# EAGLE design HVAC Control (EAGLE 9.6.2)
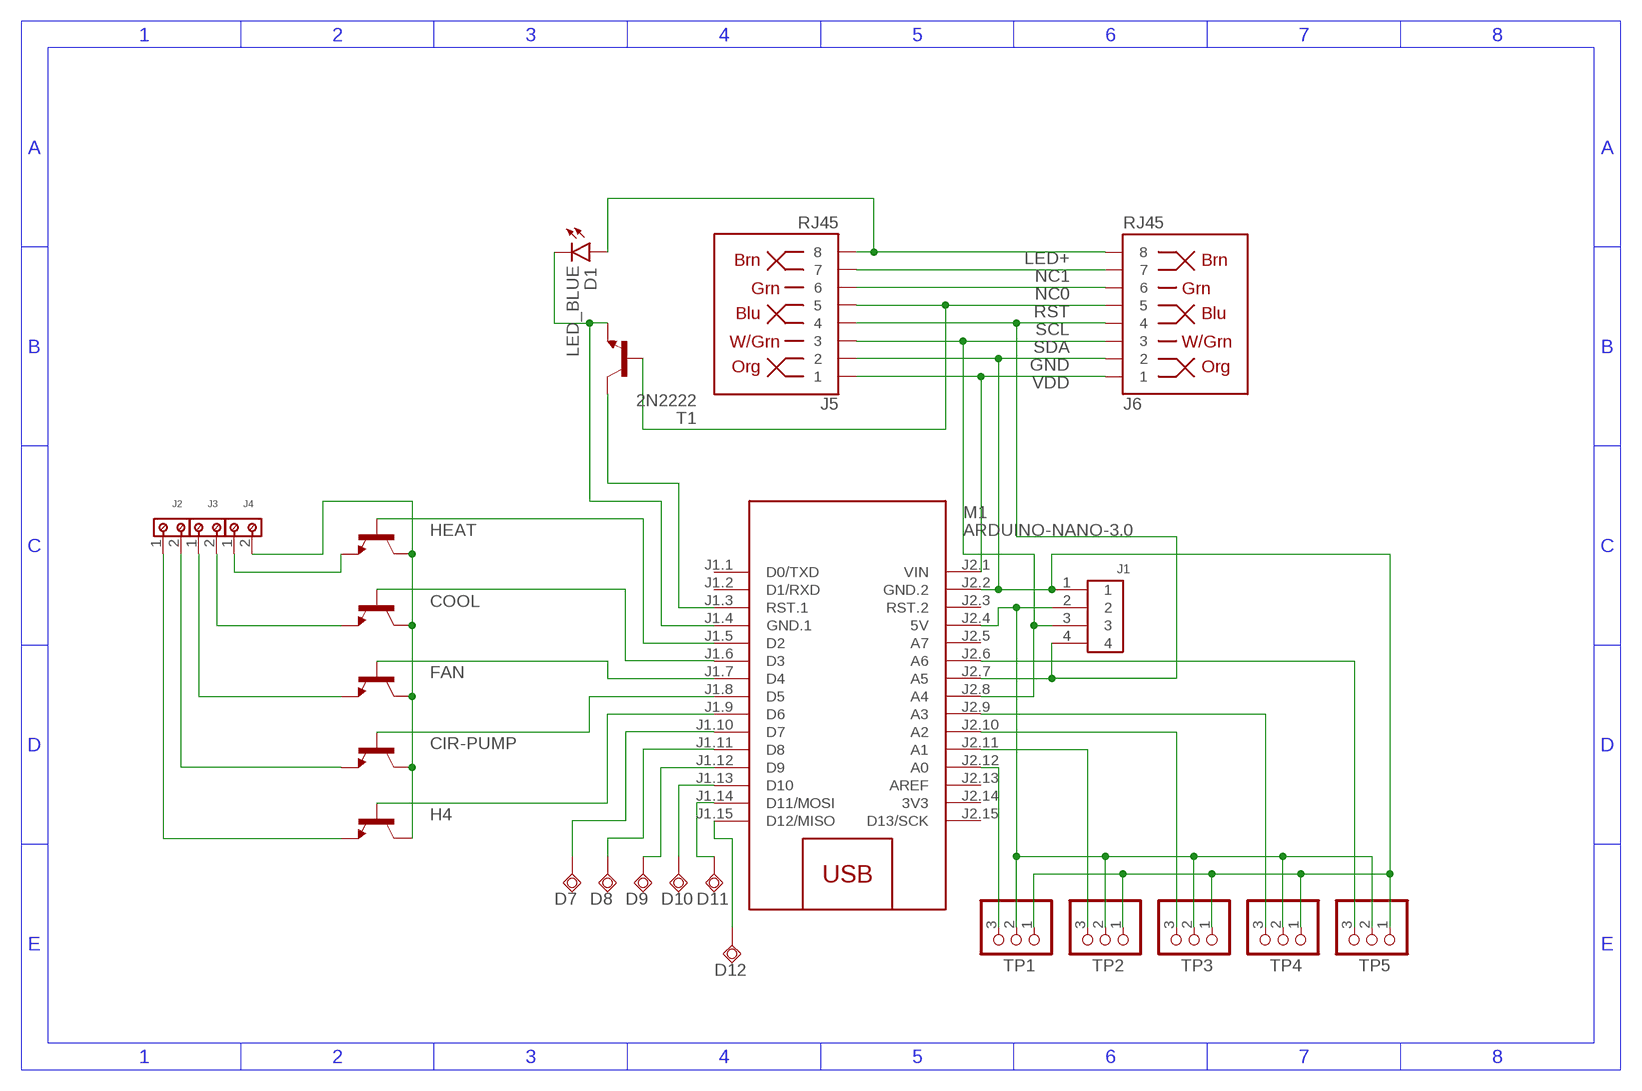
[diagram p0: schematic, sheet 1]

## Parts
CIR-PUMP  600mA/40V  TRANS_NPN-P2N2222A  [TO-92]
COOL  600mA/40V  TRANS_NPN-P2N2222A  [TO-92]
D1  LED_BLUE  LED_RADIAL_BLUE  [LEDRD254W60D565H860B_B]
D7  TESTPAD_TPSQPAD1-13  [TESTPAD_P1-13]
D8  TESTPAD_TPSQPAD1-13  [TESTPAD_P1-13]
D9  TESTPAD_TPSQPAD1-13  [TESTPAD_P1-13]
D10  TESTPAD_TPSQPAD1-13  [TESTPAD_P1-13]
D11  TESTPAD_TPSQPAD1-13  [TESTPAD_P1-13]
D12  TESTPAD_TPSQPAD1-13  [TESTPAD_P1-13]
FAN  600mA/40V  TRANS_NPN-P2N2222A  [TO-92]
H4  600mA/40V  TRANS_NPN-P2N2222A  [TO-92]
HEAT  600mA/40V  TRANS_NPN-P2N2222A  [TO-92]
J1  B4B-XH-A(LF)(SN)  [B4B-XH-A(LF)(SN)]
J2  691201820002  [691201820002]
J3  691201820002  [691201820002]
J4  691201820002  [691201820002]
J5  RJ45  RJ45-8  [RJ45-8]
J6  RJ45  RJ45-8  [RJ45-8]
M1  ARDUINO-NANO-3.0  [ARDUINO-NANO-3.0]
T1  2N2222  [TO18]
TP1  PINHD-1X3  [1X03]
TP2  PINHD-1X3  [1X03]
TP3  PINHD-1X3  [1X03]
TP4  PINHD-1X3  [1X03]
TP5  PINHD-1X3  [1X03]

## Nets
GND: J1.1 J5.2 J6.2 M1.J2.2(GND.2) M1.J2.3(RST.2) TP1.1 TP2.1 TP3.1 TP4.1 TP5.1
LED+: D1.1(A) J5.8 J6.8
N$1: D7.TP M1.J1.10(D7)
N$2: J1.2 M1.J2.4(5V) TP1.2 TP2.2 TP3.2 TP4.2 TP5.2
N$3: D8.TP M1.J1.11(D8)
N$4: D9.TP M1.J1.12(D9)
N$5: HEAT.2(B) M1.J1.5(D2)
N$6: COOL.2(B) M1.J1.6(D3)
N$7: FAN.2(B) M1.J1.7(D4)
N$8: CIR-PUMP.2(B) M1.J1.8(D5)
N$9: H4.2(B) M1.J1.9(D6)
N$10: CIR-PUMP.1(C) COOL.1(C) FAN.1(C) H4.1(C) HEAT.1(C) J4.2
N$11: H4.3(E) J2.1
N$12: CIR-PUMP.3(E) J2.2
N$13: FAN.3(E) J3.1
N$14: COOL.3(E) J3.2
N$15: HEAT.3(E) J4.1
N$16: M1.J2.12(A0) TP1.3
N$17: M1.J2.11(A1) TP2.3
N$18: M1.J2.10(A2) TP3.3
N$19: M1.J2.9(A3) TP4.3
N$20: M1.J2.6(A6) TP5.3
N$21: M1.J1.3(RST.1) T1.3(C)
N$22: D1.2(C) M1.J1.4(GND.1) T1.1(E)
N$23: D10.TP M1.J1.13(D10)
N$24: D11.TP M1.J1.14(D11/MOSI)
N$25: D12.TP M1.J1.15(D12/MISO)
NC0: J5.6 J6.6
NC1: J5.7 J6.7
RST: J5.5 J6.5 T1.2(B)
SCL: J1.4 J5.4 J6.4 M1.J2.7(A5)
SDA: J1.3 J5.3 J6.3 M1.J2.8(A4)
VDD: J5.1 J6.1 M1.J2.1(VIN)
Unconnected: M1.J1.1(D0/TXD) M1.J1.2(D1/RXD) M1.J2.5(A7) M1.J2.13(AREF) M1.J2.15(D13/SCK)

## Power pins joined to a net without a drawn wire
3V3: M1.J2.14(3V3)

## Library data of the parts
CIR-PUMP COOL FAN H4 HEAT = SparkFun-DiscreteSemi:TRANS_NPN: NPN transistor Current controlled devices typically used to amplify current or used as a switch. BC547 - COM-08928 <http://www.sparkfun.com/products/8928> (TO-92 45V 100mA) (1.Collector 2.Base 3.Emitter) 2N3904 - COM-00521 <http://www.sparkfun.com/products/521> (TO-92 40V 200mA) (1.Emitter 2.Base 3.Collector) P2N2222A - COM-12852 <http://www.sparkfun.com/products/12852> (TO-92 40V 600mA) (1.Collector 2.Base 3.Emitter); PROD_ID: TRANS-09536
D1 = Opto-Electronic:LED_RADIAL: LED - Generic; CATEGORY: Opto-Electronic; SUB-CATEGORY: LED
D7-D12 = BeagleBone_Blue_R3:TESTPAD_TPSQ: Test pad
J1 = Headers:B4B-XH-A(LF)(SN): CONN HEADER VERT 4POS 2.5MM Manufacturer's datasheet <http://www.jst-mfg.com/product/pdf/eng/eXH.pdf>; CREATED_BY: PCBLayout.com; DIGIKEY_PARTNO: 455-2249-ND; MANUFACTURER: JST Sales America Inc.; MPN: B4B-XH-A(LF)(SN)
J2-J4 = Wurth_Connectors_WR-TBL Rising Cage Clamp:691201820002: WR-TBL Serie 2018 - 10.00 mm 45° Entry w. Rising Cage Clamp KIND PROPERTIES Pitch 10 mm MATERIAL PROPERTIES Insulator Material PA6/66 Insulator Flammability Rating UL94 V-0 Insulator Color Grey Contact Material Steel Contact Plating Zinc Terminal Screw Material Steel Terminal Screw Plating Zinc Wire Guard Material Copper Alloy with Tin over Nickel GENERAL INFORMATION Operating Temperature -30 up to +120 °C Compliance Lead free / RoHS ELECTRICAL PROPERTIES IR UL 16 A IR VDE 24 A Working Voltage [UL] 300 V (AC) Working Voltage [VDE] 750 V (AC) Withstanding Voltage [UL] 1600 V (AC) Withstanding Voltage [VDE] 3000 V (AC) Contact Resistance 20 mΩ MECHANICAL PROPERTIES Wire Strip Length 6 (mm) Screw M3 CERTIFICATION UL Approval E150931; E150931 Cat No. COB (2) VDE Approval 40022115 VDE Approval 40022115 Type COB PACKAGING PROPERTIES Packaging Box <https://www.we-online.com/catalog/media/o84027v209%20Family_WR-TBL_6912018200xx.jpg> Details see: https://www.we-online.com/catalog/en/TBL_10_00_2018_45-DEGREE_ENTRY_W_RISING_CAGE_CLAMP_6912018200xx/ Updated by Ella Wu 2019-12-02 2019(C) Wurth Elektronik; IR-UL: 16A; IR-VDE: 24A; PART-NUMBER: 691201820002; PINS: 2; PITCH: 10mm; TYPE: 45°; WIRE: 12 to 30 (AWG) 3.31 to 0.05 (mm²); WORKING-VOLTAGE-UL: 300V (AC); WORKING-VOLTAGE-VDE: 750V (AC)
J5 J6 = SparkFun-Connectors:RJ45-8: RJ45 Jack - 8 pin Simple RJ45, 8-pin connection. Commonly used for Cat5, Cat5e, and Cat6 Ethernet cables. Here is the connector we sell at SparkFun: RJ45 8-Pin Connector <https://www.sparkfun.com/products/643> (PRT-00643) Datasheet <https://cdn.sparkfun.com/datasheets/Prototyping/04908.pdf> It is used on this SparkFun product: SparkFun RJ45 Breakout <https://www.sparkfun.com/products/716> (BOB-00716) Note, you may also be interested in the "MAGJACK" version of this. It is basically a RJ45 connector, but also has some status LEDs built into the connector housing. You can check that out in this library at the device named "MAGJACK.dev" and see these products online: RJ45 Ethernet MagJack-Compatible <https://www.sparkfun.com/products/8534> (PRT-08534) SparkFun RJ45 MagJack Breakout <https://www.sparkfun.com/products/13021> (BOB-13021); PROD_ID: CONN-08506; SF_ID: PRT-00643
M1 = diy-modules-2:ARDUINO-NANO-3.0: Arduino Nano 3.0
T1 = transistor:2N2222: NPN TRANSISTOR
TP1-TP5 = Connector:PINHD-1X3: PIN HEADER; CATEGORY: CONNECTOR; SUB-CATEGORY: PIN-HEADER

## Board
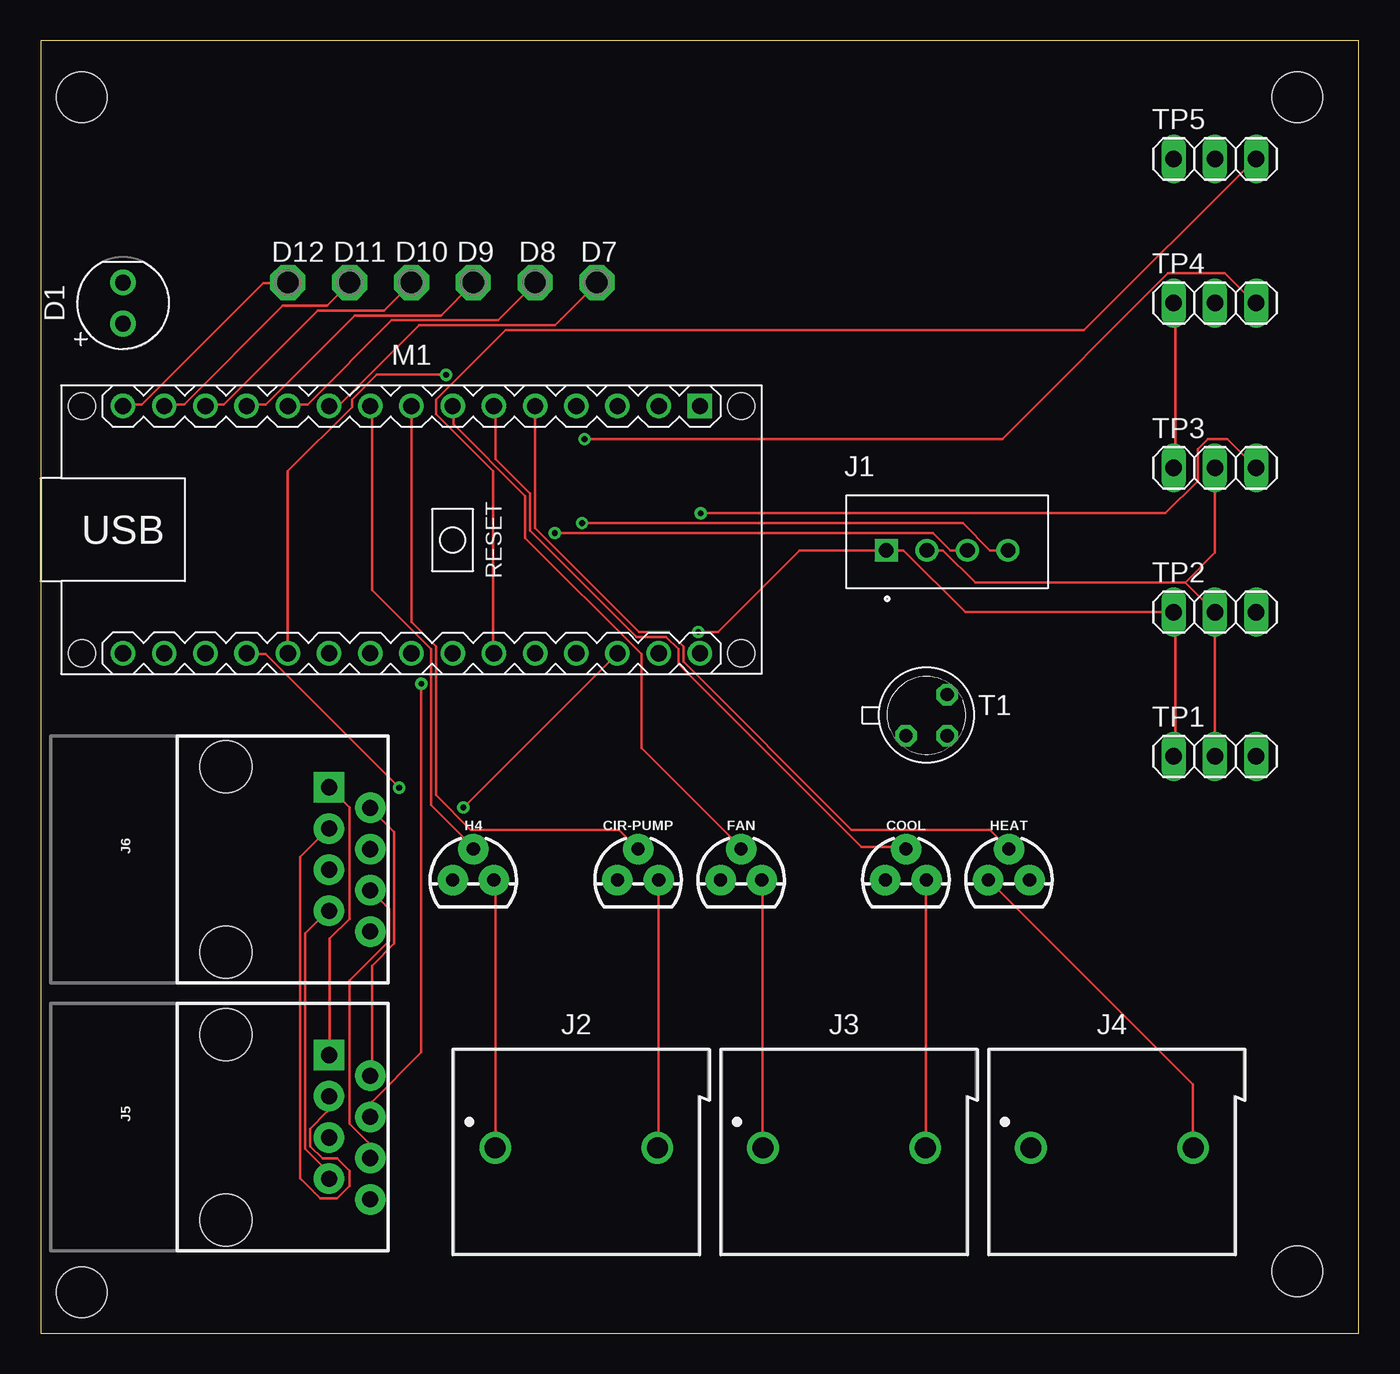
[diagram p1: board, top side]
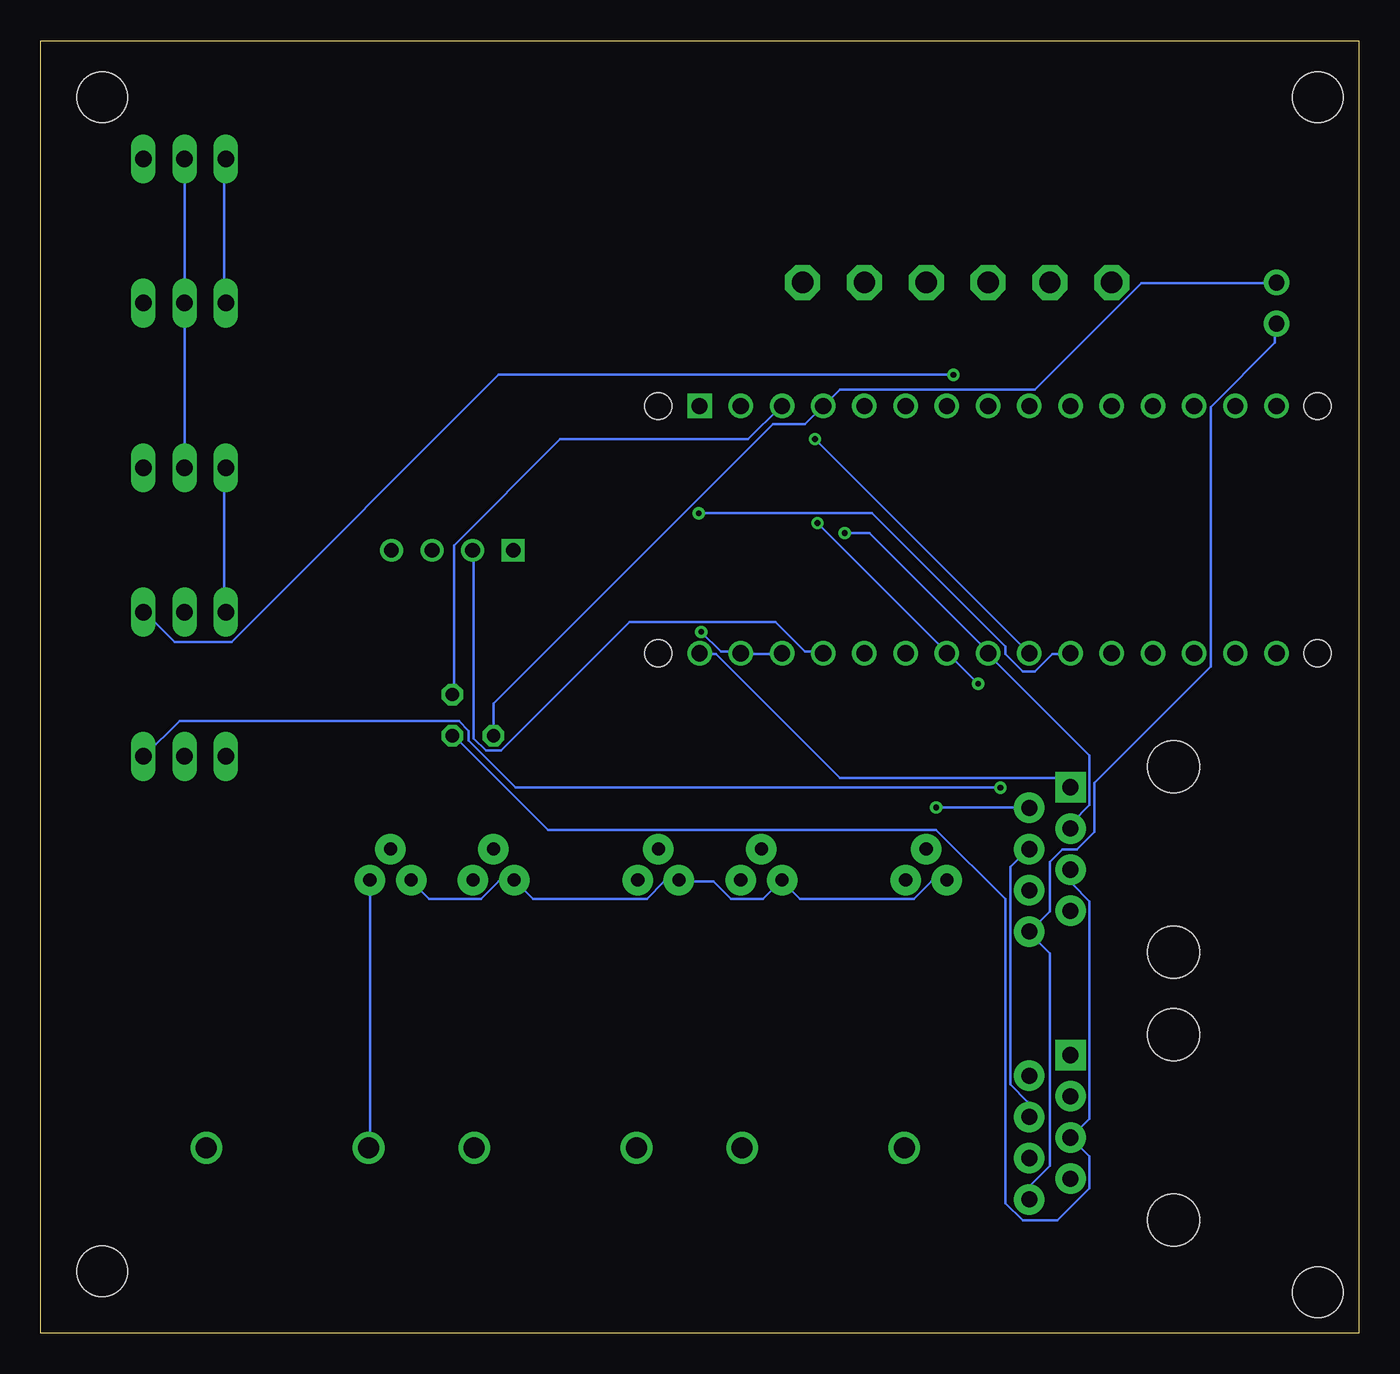
[diagram p2: board, bottom side, seen from below]

Size 81.26 x 79.68 mm. Coordinates in mm from the lower left corner, seen from the top.
Outline: 0,0 81.26,0 81.26,79.68 0,79.68 0,0
Copper layers (1*16): Top 0.035mm / dielectric 0.15mm / Bottom 0.035mm
Design rules "default": minimum track width 6mil, minimum drill 0.35mm, track to track 6mil, track to pad 6mil, pad to pad 6mil, via to via 6mil, smd to smd 6mil, copper to edge 40mil, drill to drill 6mil, minimum pad ring 10mil, minimum via ring 8mil, stop-mask expansion 4mil, vias tented up to drill 0mil, thermal gap 10mil
Holes 3.1 mm at 2.54,76.2 77.47,76.2 77.47,3.81 2.54,2.54

### Footprints (pad centres in the part's own frame; a part is rotated, then mirrored left to right if it is on the bottom)
TO-92 = drill 0.813 pad 1.88: 1 -1.27,0; 2 0,1.905; 3 1.27,0
LEDRD254W60D565H860B_B = drill 0.981 pad 1.581: 1 -1.27,0; 2 1.27,0
TESTPAD_P1-13 = drill 1.321 pad 2.159 octagon: TP 0,0
B4B-XH-A(LF)(SN) = drill 0.9 square: 1 -3.75,0 | drill 0.9: 2 -1.25,0; 3 1.25,0; 4 3.75,0
691201820002 = drill 1.3: 1 -5,0; 2 5,0
RJ45-8 = drill 1 pad 1.88 square: 1 -4.445,6.35 | drill 1 pad 1.88: 2 -3.175,8.89; 3 -1.905,6.35; 4 -0.635,8.89; 5 0.635,6.35; 6 1.905,8.89; 7 3.175,6.35; 8 4.445,8.89 | hole 3.2: -5.715,0; 5.715,0
ARDUINO-NANO-3.0 = drill 1 square: J1.1 17.78,7.62 | drill 1: J1.2 15.24,7.62; J1.3 12.7,7.62; J1.4 10.16,7.62; J1.5 7.62,7.62; J1.6 5.08,7.62; J1.7 2.54,7.62; J1.8 0,7.62; J1.9 -2.54,7.62; J1.10 -5.08,7.62; J1.11 -7.62,7.62; J1.12 -10.16,7.62; J1.13 -12.7,7.62; J1.14 -15.24,7.62; J1.15 -17.78,7.62; J2.1 17.78,-7.62; J2.2 15.24,-7.62; J2.3 12.7,-7.62; J2.4 10.16,-7.62; J2.5 7.62,-7.62; J2.6 5.08,-7.62; J2.7 2.54,-7.62; J2.8 0,-7.62; J2.9 -2.54,-7.62; J2.10 -5.08,-7.62; J2.11 -7.62,-7.62; J2.12 -10.16,-7.62; J2.13 -12.7,-7.62; J2.14 -15.24,-7.62; J2.15 -17.78,-7.62 | hole 1.651: -20.32,7.62; -20.32,-7.62; 20.32,-7.62; 20.32,7.62
TO18 = drill 0.813 octagon: 1 -1.27,-1.27; 2 1.27,-1.27; 3 1.27,1.27
1X03 = drill 1.016 long: 1 -2.54,0; 2 0,0; 3 2.54,0

### Placement (x,y rotation side)
CIR-PUMP  36.83,27.94 0 top
COOL  53.34,27.94 0 top
D1  5.08,63.5 90 top
D7  34.29,64.77 0 top
D8  30.48,64.77 0 top
D9  26.67,64.77 0 top
D10  22.86,64.77 0 top
D11  19.05,64.77 0 top
D12  15.24,64.77 0 top
FAN  43.18,27.94 0 top
H4  26.67,27.94 0 top
HEAT  59.69,27.94 0 top
J1  55.88,48.26 0 top
J2  33.02,11.43 0 top
J3  49.53,11.43 0 top
J4  66.04,11.43 0 top
J5  11.43,12.7 270 top
J6  11.43,29.21 270 top
M1  22.86,49.53 0 top
T1  54.61,38.1 0 top
TP1  72.39,35.56 0 top
TP2  72.39,44.45 0 top
TP3  72.39,53.34 0 top
TP4  72.39,63.5 0 top
TP5  72.39,72.39 0 top

### Tracks (layer width: path | path; a pad name or v marks a point on that pad's centre or on a via)
GND  (via drill 0.35)
  Top 0.152: J5.2 20.42,15.95 20.42,22.66 21.79,24.03 21.79,30.89 20.42,32.26 J6.2 | TP1.1 69.95,35.61 69.95,44.45 TP2.1 57,44.45 53.19,48.26 J1.1 46.79,48.26 41.76,43.23 v40.54,43.23 | TP4.1 69.95,63.5 69.95,53.44 TP3.1 | M1.J2.3 v26.06,32.41
  Bottom 0.152: TP4.1 69.95,63.5 69.95,72.34 TP5.1 | M1.J2.3 35.66,41.86 38.1,41.86 M1.J2.2 38.1,42.01 39.32,42.01 v40.54,43.23 | TP3.1 69.95,53.29 69.95,44.45 TP2.1 | v26.06,32.41 20.42,32.41 J6.2
LED+
  Bottom 0.152: D1.1 5.18,62.13 5.18,61.06 9.14,57.1 9.14,41.1 16.31,33.93 16.31,30.89 17.37,29.82 18.29,29.82 19.05,29.06 19.05,26.01 20.27,24.79 J6.8 20.27,24.64 19.05,23.42 19.05,10.31 20.27,9.09 20.27,8.33 J5.8
N$1
  Top 0.152: M1.J1.10 17.83,57.25 18.44,57.25 23.32,62.13 31.7,62.13 34.29,64.72 D7.TP
N$2
  Top 0.152: J1.2 55.63,48.26 57.61,46.28 70.56,46.28 | 70.56,46.28 TP2.2 TP1.2 | TP3.2 72.39,48.11 70.56,46.28
  Bottom 0.152: TP5.2 TP4.2 TP3.2 | M1.J2.4 33.07,42.01 34.14,42.01 35.97,43.84 44.96,43.84 52.88,35.92 53.8,35.92 54.56,36.68 54.56,48.26 J1.2
N$3
  Top 0.152: M1.J1.11 15.24,57.25 16.46,57.25 21.64,62.43 28.19,62.43 30.48,64.72 D8.TP
N$4
  Top 0.152: M1.J1.12 12.8,57.25 13.87,57.25 19.36,62.74 24.69,62.74 26.67,64.72 D9.TP
N$5
  Top 0.152: M1.J1.5 30.48,49.63 36.88,43.23 38.71,43.23 39.62,42.32 39.62,41.4 49.99,31.04 58.52,31.04 59.59,29.97 HEAT.2
N$6
  Top 0.152: M1.J1.6 28.04,57.1 28.04,53.9 30.18,51.76 30.18,49.48 36.73,42.93 38.56,42.93 39.32,42.16 39.32,41.25 50.6,29.97 53.34,29.97 COOL.2
N$7
  Top 0.152: M1.J1.7 25.45,57.1 25.45,56.03 29.87,51.61 29.87,49.02 37.03,41.86 37.03,36.07 43.13,29.97 FAN.2
N$8
  Top 0.152: M1.J1.8 22.86,43.84 24.38,42.32 24.38,33.17 26.52,31.04 35.66,31.04 36.73,29.97 CIR-PUMP.2
N$9
  Top 0.152: M1.J1.9 20.42,57.1 20.42,45.82 24.08,42.16 24.08,32.56 26.67,29.97 H4.2
N$10
  Top 0.152: HEAT.1 71.02,15.34 71.02,11.53 J4.2
  Bottom 0.152: H4.1 25.45,27.84 26.36,27.84 27.43,26.77 34.44,26.77 35.51,27.84 CIR-PUMP.1 36.73,26.77 38.71,26.77 39.78,27.84 41.91,27.84 | HEAT.1 58.37,27.84 57.3,26.77 54.1,26.77 53.03,27.84 52.12,27.84 COOL.1 50.9,26.77 43.89,26.77 42.82,27.84 41.91,27.84 | 41.91,27.84 FAN.1
N$11
  Top 0.152: H4.3 28.04,27.84 28.04,11.53 J2.1
N$12
  Top 0.152: CIR-PUMP.3 38.1,11.53 J2.2
N$13
  Top 0.152: FAN.3 44.5,27.84 44.5,11.53 J3.1
N$14
  Top 0.152: COOL.3 54.56,27.84 54.56,11.53 J3.2
N$15
  Bottom 0.152: HEAT.3 60.96,11.53 J4.1
N$16  (via drill 0.35)
  Top 0.152: v22.1,33.63 13.87,41.86 12.8,41.86 M1.J2.12
  Bottom 0.152: v22.1,33.63 51.97,33.63 54.86,36.52 54.86,37.13 55.47,37.74 72.69,37.74 74.83,35.61 TP1.3
N$17  (via drill 0.35)
  Top 0.152: M1.J2.11 15.24,53.14 19.2,57.1 19.2,57.56 20.73,59.08 v24.99,59.08
  Bottom 0.152: v24.99,59.08 53.03,59.08 69.49,42.62 73,42.62 74.83,44.45 TP2.3
N$18  (via drill 0.35)
  Top 0.152: v40.69,50.55 69.34,50.55 71.32,52.53 71.32,54.51 71.93,55.12 73.15,55.12 TP3.3
  Bottom 0.152: v40.69,50.55 30.02,50.55 21.79,42.32 21.79,41.86 20.73,40.79 19.96,40.79 18.9,41.86 17.83,41.86 M1.J2.10
N$19  (via drill 0.35)
  Top 0.152: v33.53,55.12 59.28,55.12 69.49,65.33 73,65.33 74.83,63.5 TP4.3
  Bottom 0.152: v33.53,55.12 M1.J2.9
N$20
  Top 0.152: M1.J2.6 27.89,42.01 27.89,53.14 24.38,56.64 24.38,57.56 28.65,61.82 64.31,61.82 74.83,72.34 TP5.3
N$21
  Bottom 0.152: T1.3 55.78,39.42 55.78,48.57 49.23,55.12 37.64,55.12 35.66,57.1 M1.J1.3
N$22
  Bottom 0.152: T1.1 53.34,38.81 36.12,56.03 34.14,56.03 M1.J1.4 32,58.17 19.96,58.17 13.41,64.72 5.18,64.72 D1.2
N$23
  Top 0.152: M1.J1.13 10.21,57.25 11.28,57.25 17.07,63.04 21.18,63.04 22.86,64.72 D10.TP
N$24
  Top 0.152: M1.J1.14 7.62,57.25 8.84,57.25 14.94,63.35 17.68,63.35 19.05,64.72 D11.TP
N$25
  Top 0.152: M1.J1.15 5.18,57.25 6.25,57.25 13.72,64.72 15.24,64.72 D12.TP
NC0
  Top 0.152: J5.6 20.27,10.92 20.27,11.68 19.05,12.9 19.05,21.74 21.49,24.18 21.49,26.16 20.42,27.23 J6.6
NC1
  Top 0.152: J5.7 17.68,9.55 17.68,10.01 16.31,11.38 16.31,24.64 17.68,26.01 J6.7
RST
  Bottom 0.152: T1.2 55.78,36.83 49.99,31.04 26.06,31.04 21.79,26.77 21.79,8.03 20.73,6.96 18.59,6.96 16.61,8.94 16.61,10.92 17.68,11.99 J5.5 17.68,12.14 16.61,13.21 16.61,26.62 17.68,27.69 17.68,28.45 J6.5
SCL  (via drill 0.35)
  Top 0.152: J1.4 58.52,48.26 56.84,49.94 v33.38,49.94 | v23.47,40.03 23.47,17.32 20.42,14.27 20.42,13.36 J5.4
  Bottom 0.152: J5.4 20.42,13.36 20.42,14.27 21.49,15.34 21.49,28.75 20.42,29.82 J6.4 | v33.38,49.94 25.45,42.01 M1.J2.7 25.3,41.86 v23.47,40.03
SDA  (via drill 0.35)
  Top 0.152: J5.3 17.68,14.58 17.68,13.66 16.61,12.6 16.61,11.53 17.37,10.77 18.29,10.77 19.05,10.01 19.05,9.09 18.29,8.33 17.22,8.33 16,9.55 16,29.36 17.68,31.04 J6.3 | J1.3 56.08,48.26 55.02,49.33 v31.7,49.33
  Bottom 0.152: v31.7,49.33 30.18,49.33 22.86,42.01 M1.J2.8 22.86,41.86 16.61,35.61 16.61,32.56 17.68,31.5 17.68,31.19 J6.3
VDD
  Top 0.152: J5.1 17.83,17.17 17.83,24.33 19.05,25.55 19.05,32.41 17.83,33.63 J6.1
  Bottom 0.152: M1.J2.1 40.54,41.86 39.62,41.86 32,34.24 18.29,34.24 17.83,33.78 J6.1